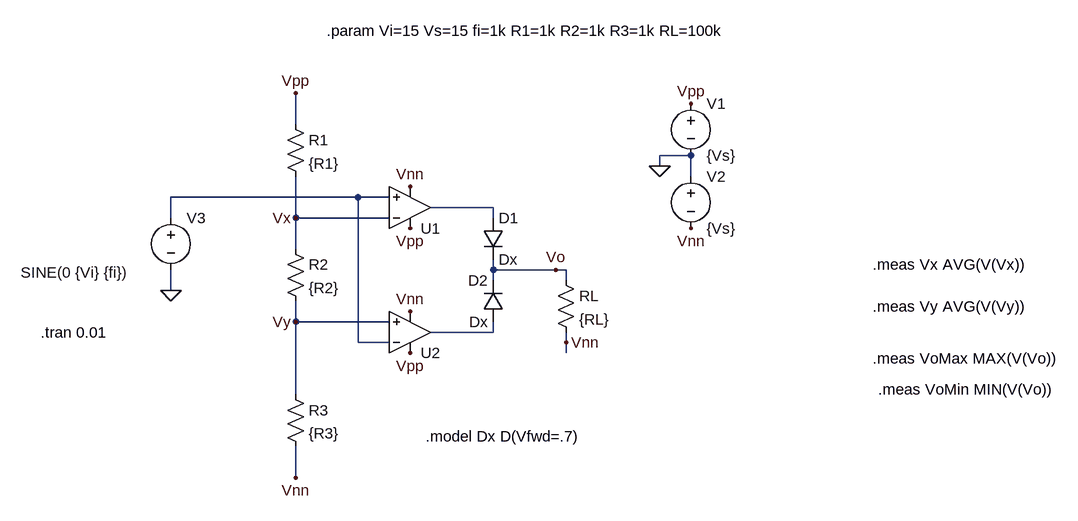
[diagram p0: schematic CompJanela3.asc]
CompJanela3.asc, the LTspice schematic file:
Version 4
SHEET 1 1100 744
WIRE -96 96 -96 48
WIRE 512 144 464 144
WIRE 464 160 464 144
WIRE 512 176 512 144
WIRE 0 208 -288 208
WIRE 48 208 0 208
WIRE 208 224 112 224
WIRE -288 240 -288 208
WIRE -96 240 -96 176
WIRE 48 240 -96 240
WIRE 208 240 208 224
WIRE -96 288 -96 240
WIRE 208 320 208 304
WIRE 304 320 208 320
WIRE 320 320 304 320
WIRE 208 336 208 320
WIRE 320 336 320 320
WIRE -288 352 -288 320
WIRE -96 400 -96 368
WIRE 48 400 -96 400
WIRE 208 416 208 400
WIRE 208 416 112 416
WIRE 0 432 0 208
WIRE 48 432 0 432
WIRE 320 432 320 416
WIRE 320 448 320 432
WIRE -96 512 -96 400
WIRE -96 640 -96 592
FLAG 512 64 Vpp
FLAG 464 160 0
FLAG 512 256 Vnn
FLAG 304 320 Vo
FLAG -288 352 0
FLAG -96 48 Vpp
FLAG -96 240 Vx
FLAG -96 400 Vy
FLAG -96 640 Vnn
FLAG 320 432 Vnn
FLAG 80 192 Vnn
FLAG 80 384 Vnn
FLAG 80 256 Vpp
FLAG 80 448 Vpp
SYMBOL voltage 512 48 R0
WINDOW 123 0 0 Left 0
WINDOW 39 0 0 Left 0
SYMATTR InstName V1
SYMATTR Value {Vs}
SYMBOL voltage 512 160 R0
WINDOW 123 0 0 Left 0
WINDOW 39 0 0 Left 0
SYMATTR InstName V2
SYMATTR Value {Vs}
SYMBOL res 304 320 R0
SYMATTR InstName RL
SYMATTR Value {RL}
SYMBOL res -112 80 R0
SYMATTR InstName R1
SYMATTR Value {R1}
SYMBOL voltage -288 224 R0
WINDOW 3 -231 100 Left 2
WINDOW 123 0 0 Left 0
WINDOW 39 0 0 Left 0
SYMATTR Value SINE(0 {Vi} {fi})
SYMATTR InstName V3
SYMBOL res -112 272 R0
SYMATTR InstName R2
SYMATTR Value {R2}
SYMBOL res -112 496 R0
SYMATTR InstName R3
SYMATTR Value {R3}
SYMBOL diode 192 240 R0
SYMATTR InstName D1
SYMATTR Value Dx
SYMBOL diode 224 400 R180
WINDOW 0 24 64 Left 2
WINDOW 3 24 0 Left 2
SYMATTR InstName D2
SYMATTR Value Dx
SYMBOL OpAmps\\UniversalOpamp2 80 224 M180
SYMATTR InstName U1
SYMBOL OpAmps\\UniversalOpamp2 80 416 M180
SYMATTR InstName U2
TEXT -48 -48 Left 2 !.param Vi=15 Vs=15 fi=1k R1=1k R2=1k R3=1k RL=100k
TEXT -488 416 Left 2 !.tran 0.01
TEXT 104 576 Left 2 !.model Dx D(Vfwd=.7)
TEXT 792 312 Left 2 !.meas Vx AVG(V(Vx))
TEXT 792 376 Left 2 !.meas Vy AVG(V(Vy))
TEXT 792 456 Left 2 !.meas VoMax MAX(V(Vo))
TEXT 800 504 Left 2 !.meas VoMin MIN(V(Vo))

The netlist it stands for:
* CompJanela3.asc
V1 Vpp 0 {Vs}
V2 0 Vnn {Vs}
RL Vo Vnn {RL}
R1 Vpp Vx {R1}
V3 N001 0 SINE(0 {Vi} {fi})
R2 Vx Vy {R2}
R3 Vy Vnn {R3}
D1 N002 Vo Dx
D2 N003 Vo Dx
XU1 N001 Vx Vpp Vnn N002 level.2 Avol=1Meg GBW=10Meg Slew=10Meg ilimit=25m rail=0 Vos=0 phimargin=45 en=0 enk=0 in=0 ink=0 Rin=500Meg  ; pins IN+ IN- V+ V- OUT
XU2 Vy N001 Vpp Vnn N003 level.2 Avol=1Meg GBW=10Meg Slew=10Meg ilimit=25m rail=0 Vos=0 phimargin=45 en=0 enk=0 in=0 ink=0 Rin=500Meg  ; pins IN+ IN- V+ V- OUT
.model D D
.lib standard.dio
.param Vi=15 Vs=15 fi=1k R1=1k R2=1k R3=1k RL=100k
.tran 0.01
.model Dx D(Vfwd=.7)
.meas Vx AVG(V(Vx))
.meas Vy AVG(V(Vy))
.meas VoMax MAX(V(Vo))
.meas VoMin MIN(V(Vo))
.lib UniversalOpamps2.sub
.backanno
.end